# EAGLE design M_D_ext_power2 (EAGLE 9.6.2)
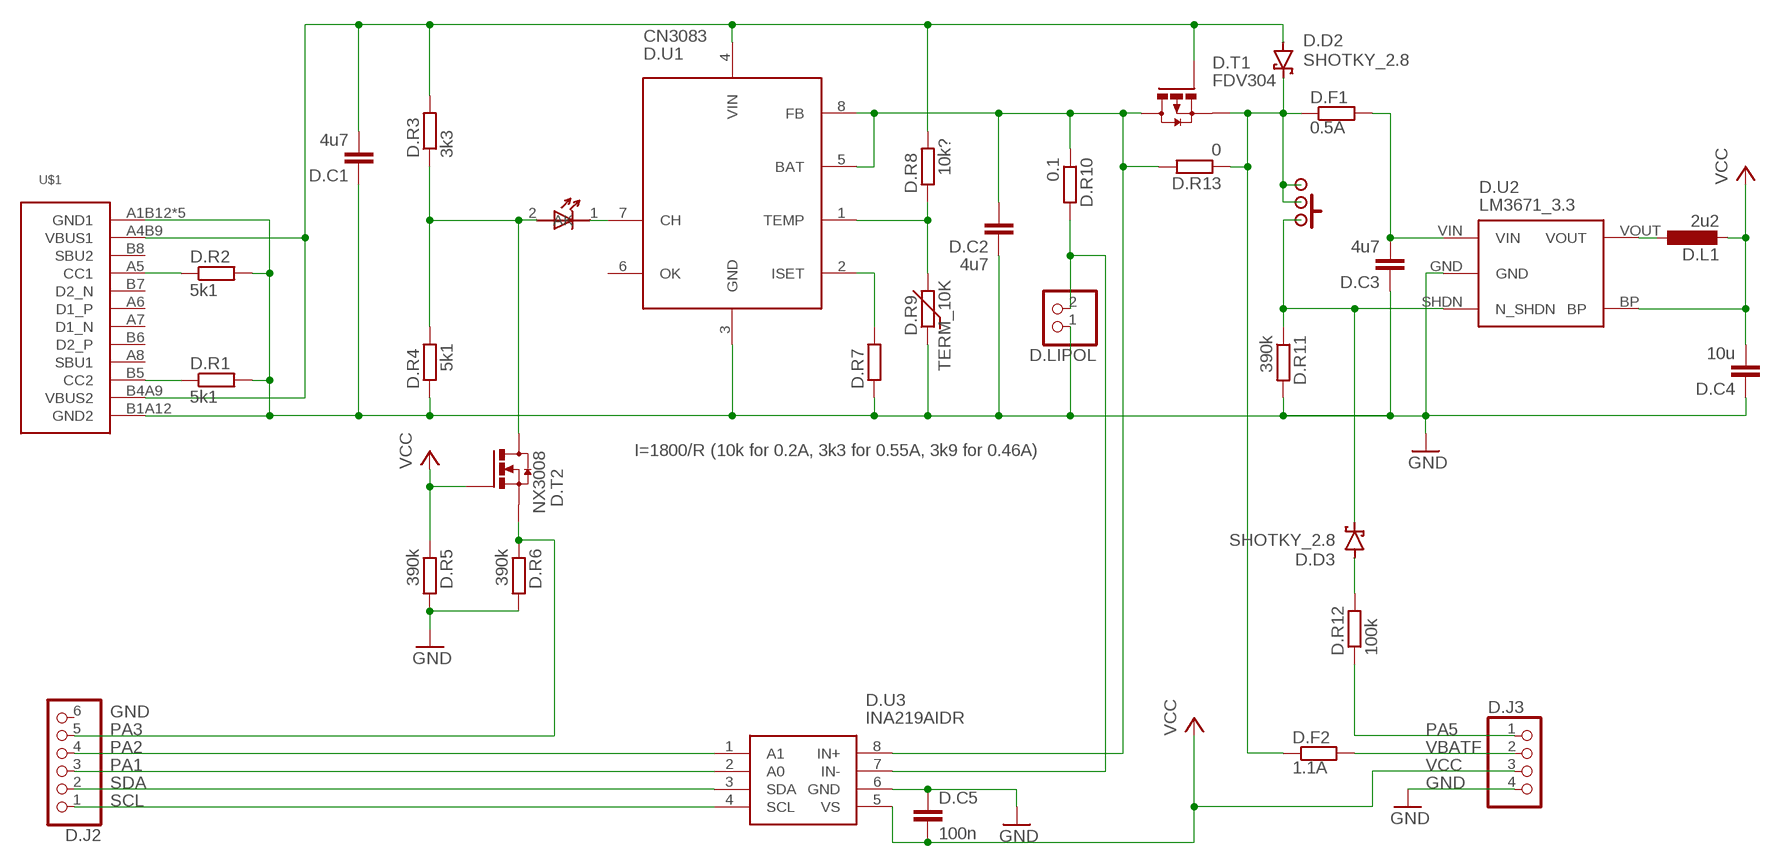
[diagram p0: schematic, sheet 1]

## Parts
D.C1  4u7  C-EUC0603  [C0603]
D.C2  4u7  C-EUC0603  [C0603]
D.C3  4u7  C-EUC0603  [C0603]
D.C4  10u  C-EUC0805  [C0805]
D.C5  100n  C-EUC0603  [C0603]
D.D1  LED_1.8  [LED_1.8]
D.D2  SHOTKY_2.8  [SHOTKY_2.8]
D.D3  SHOTKY_2.8  [SHOTKY_2.8]
D.F1  0.5A  R-EU_R0805  [R0805]
D.F2  1.1A  R-EU_R0805  [R0805]
D.J2  PINHD-1X6  [1X06]
D.J3  PINHD-1X4  [1X04]
D.L1  2u2  L-EUL3230M  [L3230M]
D.LIPOL  PINHD-1X21X2-2  [1X02-2]
D.ON/OFF/RESET  SWITCH  [SWITCH]
D.R1  5k1  R-EU_R0603  [R0603]
D.R2  5k1  R-EU_R0603  [R0603]
D.R3  3k3  R-EU_R0603  [R0603]
D.R4  5k1  R-EU_R0603  [R0603]
D.R5  390k  R-EU_R0603  [R0603]
D.R6  390k  R-EU_R0603  [R0603]
D.R7  I=1800/R (10k for 0.2A, 3k3 for 0.55A, 3k9 for 0.46A)  R-EU_R0603  [R0603]
D.R8  10k?  R-EU_R0603  [R0603]
D.R9  TERM_10K  THERM  [THERM]
D.R10  0.1  R-EU_R0805  [R0805]
D.R11  390k  R-EU_R0603  [R0603]
D.R12  100k  R-EU_R0603  [R0603]
D.R13  0  R-EU_R0603  [R0603]
D.T1  FDV304  P-MOSFET  [SO23]
D.T2  NX3008  N-MOSFET  [SO23]
D.U1  CN3083  [SOP8]
D.U2  LM3671_3.3  STABILISER_APE8865  [SOT32-5]
D.U3  INA219AIDR  [SOIC127P600X175-8N]
U$1  USB-C  [USB-C]

## Nets
CHRG: D.D1.2(A) D.R3.1 D.R4.2 D.T2.D
GND: D.C1.1 D.C2.1 D.C3.1 D.C4.1 D.C5.1 D.J3.4 D.LIPOL.1 D.R1.2 D.R2.2 D.R4.1 D.R5.2 D.R6.2 D.R7.1 D.R9.1 D.R11.2 D.U1.3(GND) D.U2.GND D.U3.6(GND) U$1.A1B12(GND1) U$1.B1A12(GND2) U$1.SH1(GND1) U$1.SH2(GND1) U$1.SH3(GND1) U$1.SH4(GND1)
IN+: D.LIPOL.2 D.R10.2 D.U3.7(IN-)
IN-: D.C2.2 D.R10.1 D.R13.2 D.T1.D D.U1.5(BAT) D.U1.8(FB) D.U3.8(IN+)
N$1: D.C3.2 D.F1.2 D.U2.VIN
N$2: D.L1.1 D.U2.VOUT
N$3: D.D1.1(K) D.U1.7(CH)
N$4: D.R1.1 U$1.B5(CC2)
N$5: D.D3.A D.R12.2
N$6: D.R2.1 U$1.A5(CC1)
N$7: D.R7.2 D.U1.2(ISET)
N$8: D.R8.1 D.R9.2 D.U1.1(TEMP)
N$10: D.D3.K(C) D.ON/OFF/RESET.P$1 D.ON/OFF/RESET.P$5 D.ON/OFF/RESET.P$7 D.R11.1 D.U2.SHDN(N_SHDN)
PA1: D.J2.3 D.U3.2(A0)
PA2: D.J2.4 D.U3.1(A1)
PA3: D.J2.5 D.R6.1 D.T2.S
PA5: D.C1.2 D.D2.A D.R3.2 D.R8.2 D.T1.G D.U1.4(VIN) U$1.A4B9(VBUS1) U$1.B4A9(VBUS2)
PA5-1: D.J3.1 D.R12.1
SCL: D.J2.1 D.U3.4(SCL)
SDA: D.J2.2 D.U3.3(SDA)
VBATF: D.F2.2 D.J3.2
VCC: D.C4.2 D.C5.2 D.J3.3 D.L1.2 D.R5.1 D.T2.G D.U2.BP D.U3.5(VS)
VMOT: D.D2.K(C) D.F1.1 D.F2.1 D.ON/OFF/RESET.P$2 D.ON/OFF/RESET.P$3 D.ON/OFF/RESET.P$4 D.ON/OFF/RESET.P$6 D.R13.1 D.T1.S
Unconnected: D.J2.6 D.U1.6(OK) U$1.A6(D1_P) U$1.A7(D1_N) U$1.A8(SBU1) U$1.B6(D2_P) U$1.B7(D2_N) U$1.B8(SBU2)

## Library data of the parts
D.C1-D.C5 = rcl:C-EU: CAPACITOR, European symbol; SPICEPREFIX: C
D.D1 = hugo:LED_1.8
D.D2 D.D3 = hugo:SHOTKY_2.8
D.F1 D.F2 D.R1-D.R8 D.R10-D.R13 = rcl:R-EU_: RESISTOR, European symbol; SPICEPREFIX: R
D.J2 = pinhead2:PINHD-1X6: PIN HEADER
D.J3 = pinhead2:PINHD-1X4: PIN HEADER
D.L1 = rcl:L-EU: INDUCTOR, European symbol; SPICEPREFIX: L
D.LIPOL = pinhead2:PINHD-1X2: PIN HEADER
D.ON/OFF/RESET = hugo:SWITCH
D.R9 = hugo:THERM
D.T1 = hugo:P-MOSFET
D.T2 = hugo:N-MOSFET
D.U1 = hugo:CN3083
D.U2 = !stavebnice03:STABILISER_APE8865
D.U3 = SamacSys_Parts:INA219AIDR: 26-V, Bidirectional, Zero-Drift, High-Side, I2C Out Current/Power Monitor Source: Datasheet <http://www.ti.com/lit/gpn/ina219>; DESCRIPTION: 26-V, Bidirectional, Zero-Drift, High-Side, I2C Out Current/Power Monitor; HEIGHT: 1.75mm; MANUFACTURER_NAME: Texas Instruments; MANUFACTURER_PART_NUMBER: INA219AIDR; MOUSER_PART_NUMBER: 595-INA219AIDR; MOUSER_PRICE-STOCK: https://www.mouser.co.uk/ProductDetail/Texas-Instruments/INA219AIDR?qs=XGzIaZb%2FFYIE5YcOHTnKDA%3D%3D
U$1 = hugo:USB-C

## Board
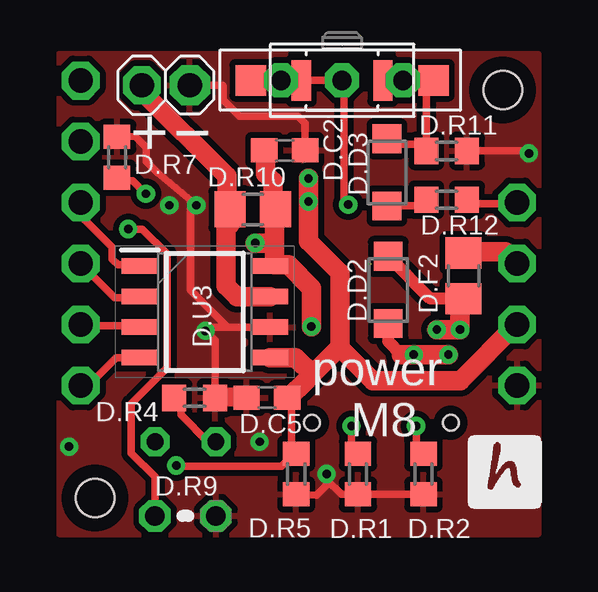
[diagram p1: board, top side]
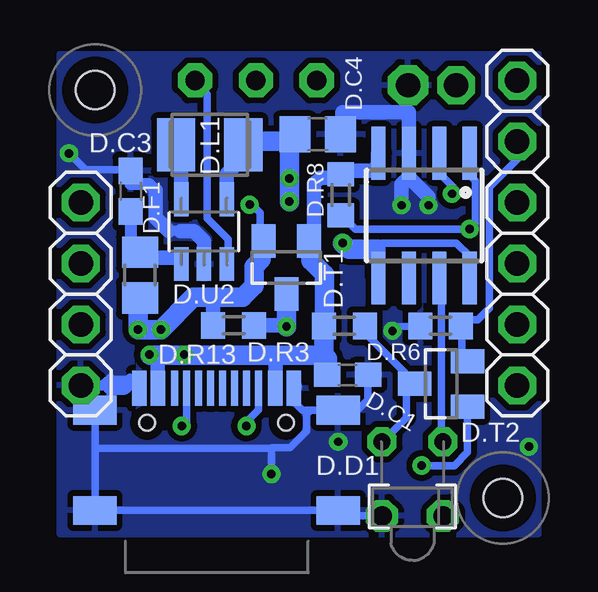
[diagram p2: board, bottom side, seen from below]

No outline drawn. Coordinates in mm, seen from the top.
Copper layers (1*16): Top 0.035mm / dielectric 1.5mm / Bottom 0.035mm
Design rules "default *": minimum track width 10mil, minimum drill 0.35mm, track to track 6mil, track to pad 6mil, pad to pad 6mil, via to via 10mil, smd to smd 10mil, copper to edge 15mil, drill to drill 15mil, minimum pad ring 10mil, minimum via ring 8mil, stop-mask expansion 4mil, vias tented up to drill 14mil, thermal gap 10mil
Holes 1.6 mm at 2,2 19,19
tRestrict: area 18,18 to 20,20; area 1,1 to 3,3
bRestrict: area 1,1 to 3,3; area 18,18 to 20,20

### Footprints (pad centres in the part's own frame; a part is rotated, then mirrored left to right if it is on the bottom)
C0603 = smd 1.1 x 1: 1 -0.85,0; 2 0.85,0
C0805 = smd 1.3 x 1.5: 1 -0.95,0; 2 0.95,0
LED_1.8 = drill 0.7 octagon: 1 -1.27,-0.4; 2 1.27,-0.4
SHOTKY_2.8 = smd 1.2 x 1.2: A -1.4,0; K 1.4,0
R0805 = smd 1.3 x 1.5: 1 -0.95,0; 2 0.95,0
1X06 = drill 1.016 pad 1.575 octagon: 1 -6.35,0; 2 -3.81,0; 3 -1.27,0; 4 1.27,0; 5 3.81,0; 6 6.35,0
1X04 = drill 1.016 pad 1.575 octagon: 1 -3.81,0; 2 -1.27,0; 3 1.27,0; 4 3.81,0
L3230M = smd 1.6 x 2.2: 1 -1.4,0; 2 1.4,0
1X02-2 = drill 1.016 pad 1.676 octagon: 1 -1,0 | drill 1.016 pad 1.575 octagon: 2 1,0
SWITCH = drill 0.8 pad 1.422 octagon: P$1 2.54,0; P$2 0,0; P$3 -2.54,0 | smd 0.8 x 1.7: P$4 -1.7,0; P$5 1.7,0 | smd 1.27 x 1.27: P$6 -3.81,0; P$7 3.81,0
R0603 = smd 1 x 1.1: 1 -0.85,0; 2 0.85,0
THERM = drill 0.813 octagon: 1 -1.27,0; 2 1.27,0
SO23 = smd 1 x 1.4: D 0,1.1; G -0.95,-1.1; S 0.95,-1.1
SOP8 = smd 0.6 x 2.2: 1 -1.905,-2.6; 2 -0.635,-2.6; 3 0.635,-2.6; 4 1.905,-2.6; 5 1.905,2.6; 6 0.635,2.6; 7 -0.635,2.6; 8 -1.905,2.6
SOT32-5 = smd 0.6 x 1.4: BP 0.95,1.35; GND 0,-1.35; SHDN 0.95,-1.35; VIN -0.95,-1.35; VOUT -0.95,1.35
SOIC127P600X175-8N = smd 1.528 x 0.65: 1 -2.711,1.905; 2 -2.711,0.635; 3 -2.711,-0.635; 4 -2.711,-1.905; 5 2.711,-1.905; 6 2.711,-0.635; 7 2.711,0.635; 8 2.711,1.905
USB-C = smd 0.6 x 1.45: A1B12 -3.235,3.825; A4B9 -2.46,3.825; B1A12 3.215,3.825; B4A9 2.44,3.825 | smd 0.3 x 1.45: A5 -1.26,3.825; A6 -0.26,3.825; A7 0.24,3.825; A8 1.24,3.825; B5 1.74,3.825; B6 0.74,3.825; B7 -0.76,3.825; B8 -1.76,3.825 | smd 1.8 x 1.2: SH1 -5.08,2.91; SH2 -5.08,-1.27; SH3 5.06,-1.27; SH4 5.06,2.91 | hole 0.65: 2.88,2.38; -2.9,2.38

### Placement (x,y rotation side)
D.C1  8.47,7.13 180 bottom
D.C2  9.91,16.49 180 top
D.C3  17.53,14.78 270 bottom
D.C4  9.72,17.15 180 bottom
D.C5  9.17,6.17 0 top
D.D1  5.77,3.95 180 bottom
D.D2  14.22,10.67 90 top
D.D3  14.17,15.57 90 top
D.F1  17.13,11.29 90 bottom
D.F2  17.36,11.26 90 top
D.J2  1.4,13.04 90 bottom
D.J3  19.6,10.5 270 bottom
D.L1  14.22,16.71 0 bottom
D.LIPOL  4.95,19.2 180 top
D.ON/OFF/RESET  12.3,19.4 0 top
D.R1  12.96,3 270 top
D.R2  15.7,3 270 top
D.R3  8.61,9.17 180 bottom
D.R4  6.15,6.17 180 top
D.R5  10.39,3 270 top
D.R6  4.6,9.17 180 bottom
D.R7  2.91,16.2 270 top
D.R8  8.76,14.63 90 bottom
D.R9  5.77,1.25 180 top
D.R10  8.58,14.03 180 top
D.R11  16.66,16.46 0 top
D.R12  16.66,14.43 180 top
D.R13  13.23,9.19 0 bottom
D.T1  11.03,11.61 180 bottom
D.T2  4.57,6.76 90 bottom
D.U1  5.28,13.77 180 bottom
D.U2  14.47,13.1 0 bottom
D.U3  6.58,9.75 0 top
U$1  13.93,2.75 0 bottom

### Tracks (layer width: path | path; a pad name or v marks a point on that pad's centre or on a via)
CHRG
  Top 0.305: D.R4.2 5.58,5.89 5.58,5.47 6.7,4.35 D.D1.2
  Bottom 0.305: 7.76,9.05 D.R3.1 7.76,8.89 5.67,6.8 D.T2.D 6.03,6.4 6.03,5.35 D.D1.2
GND  (via drill 0.35)
  Top 0.305: D.C2.1 10.76,17.02 | 2.86,17.13 D.R7.1 | D.R7.1 3.14,16.86 | D.C2.1 10.87,16.38 | D.R7.1 3.67,17.08 4.14,16.61 4.14,16.03 4.61,15.55 v6.22,14.2 5.98,14.37 5.98,10.66 7.52,9.12 | D.R5.2 11.23,2.12 11.65,2.54 v11.65,3 11.65,2.77 12.27,2.15 D.R1.2 D.R2.2 | D.LIPOL.1 7.33,19.2 7.34,19.19 7.34,18.59 8.03,17.91 10.46,17.91 10.76,17.61 D.C2.1 | D.U3.6 7.52,9.12 | D.R4.1 7,8.57 v6.6,8.97 6.75,9.12 7.52,9.12 | D.R11.2 19.99,16.46 v20.09,16.36
  Top 0.813: D.C5.1 8.31,6.19 7.05,6.24 D.R4.1
  Bottom 0.254: 6.15,17.97 6.03,18.08
  Bottom 0.305: 11.65,4.07 18.99,4.07 19.01,4.09 | U$1.SH4 8.92,5.71 9.45,5.71 9.33,5.59 8.13,5.59 7.62,6.1 D.C1.1 | U$1.SH1 19.01,4.09 | 19.01,4.09 U$1.SH2 U$1.SH3 8.64,1.25 D.R9.1 | 11.65,3.13 v11.65,3 | v11.65,3 11.63,2.97 | v20.09,16.36 19.41,15.67 17.57,15.67 D.C3.1 17.53,15.09 | v11.65,3 11.65,4.07 | D.R6.2 6.43,9.14 v6.6,8.97 | D.LIPOL.1 5.95,18.11 5.92,18.08 | 11.65,4.07 11.63,4.09 10.87,4.09 10.19,4.78 10.19,5.49 10.02,5.66 U$1.SH4 | U$1.B1A12 10.71,6.01 10.37,5.66 U$1.SH4
  Bottom 0.406: 18.37,6.98 18.5,6.85 | 18.5,6.85 18.66,6.69 | U$1.A1B12 17.56,6.97 17.84,6.69 | 18.66,6.69 D.J3.4 19.6,6.25 | 18.66,6.69 18.31,6.69 | 18.5,6.85 18.34,6.68 18.34,5.71 | 15.44,13.11 15.47,13.14 15.94,13.14
  Bottom 0.508: 17.53,15.09 16.76,15.09 16.48,14.81
  Bottom 0.61: D.U2.GND 14.46,12.7 14.88,13.11 15.44,13.11 | 8.81,5.84 8.87,5.79 U$1.SH4 8.74,5.79 | 19.6,6.25 U$1.SH1 | D.C4.1 8.69,17.15 8.69,18.07 6.51,18.07 | 6.43,18.08 6.03,18.08 5.92,18.08 D.U1.3 5.92,15.37 | U$1.B1A12 10.66,6.63 | 15.94,13.14 16.48,13.68 16.48,14.81 | 5.92,15.37 5.1,14.55 v5.1,14.2 | v6.22,14.2 6.22,15.07 5.92,15.37
  Bottom 0.813: 18.31,6.69 17.84,6.69
  other vias: 0.91,4.14 8.86,4.34
  pour Top (isolate 0.254): 0.5,20.5 0.5,0.5 20.5,0.5 20.5,20.5
  pour Bottom (isolate 0.254, rank 3): 0.5,20.5 20.5,20.5 20.5,0.5 0.5,0.5
IN+
  Top 0.813: D.LIPOL.2 3.95,18.95 7.5,15.4 7.5,14.38 7.62,14.25 D.R10.2 7.62,13.42 7.47,13.26 7.47,10.84 7.91,10.39 D.U3.7
IN-  (via drill 0.35)
  Top 0.305: 9.31,11.63 D.U3.8 9.39,11.76 9.39,12.62
  Top 0.61: v8.68,12.62 9.39,12.62
  Top 0.813: D.R10.1 9.42,14.13 9.42,15.19 9.11,15.5 9.11,16.44 D.C2.2 | D.R10.1 9.61,14.03 | v11.02,9.14 11.02,10.74 10.06,11.71 9.47,11.71 9.47,12.62 | D.R10.1 9.47,13.97 9.47,12.62 | v8.68,12.62 9.47,12.62
  Bottom 0.305: D.U1.5 7.19,12.42 | 7.19,12.47 7.04,12.62 3.94,12.62 3.38,12.06 D.U1.8
  Bottom 0.508: 7.29,12.37 7.19,12.47
  Bottom 0.61: 7.19,11.76 D.U1.5 7.19,12.47 | D.R13.2 11.07,9.2 v11.02,9.14
  Bottom 0.813: D.T1.D 11.02,10.5 v11.02,9.14 | v8.68,12.62 8.43,12.37 7.29,12.37
N$1
  Bottom 0.305: D.U2.VIN 15.41,11.93 15.49,12.01 | 16.91,12.01 D.F1.2
  Bottom 0.508: D.C3.2 17.53,12.63 D.F1.2
  Bottom 0.61: 16.91,12.01 15.49,12.01
  Bottom 0.813: D.F1.2 16.98,12.23
N$2
  Bottom 0.61: D.U2.VOUT 15.41,15.97 15.62,16.18 D.L1.1
N$3
  Bottom 0.305: D.U1.7 4.57,11.09 4.57,4.42 D.D1.1
N$4  (via drill 0.35)
  Top 0.305: D.R1.1 12.69,4.14 v12.69,5
  Bottom 0.305: U$1.B5 12.19,5.68 12.69,5.18 v12.69,5
N$5
  Top 0.305: D.D3.A 15.37,14.17 15.62,14.43 D.R12.2
N$6  (via drill 0.35)
  Top 0.305: v15.39,5 15.39,4.22 15.46,4.08 D.R2.1
  Bottom 0.305: U$1.A5 15.19,5.2 v15.39,5
N$7  (via drill 0.35)
  Top 0.305: 3.04,15.38 D.R7.2 2.91,15.21 3.56,15.21 4.09,14.68 v4.12,14.68
  Bottom 0.305: D.U1.2 4.65,15.53 4.07,14.95 4.07,14.73 v4.12,14.68
N$8  (via drill 0.35)
  Top 0.305: v3.38,13.21 3.97,13.21 5,12.17 5,7.42 3.5,5.92 3.5,3.87 4.5,2.88 D.R9.2
  Bottom 0.305: D.R8.1 8.71,13.78 8.14,13.21 v3.38,13.21 3.15,13.44 3.15,15.22 3.38,15.45 D.U1.1
N$10  (1 unrouted)
  Top 0.305: 14.54,17.33 D.D3.K 14.4,16.74 15.53,16.74 D.R11.1 15.81,19.31 15.9,19.4 | D.ON/OFF/RESET.P$5 D.ON/OFF/RESET.P$1 15.9,19.4 | 15.9,19.4 D.ON/OFF/RESET.P$7
  Bottom 0.305: 13.46,11.8 13.46,12.79 14.34,13.67 14.34,18.83 14.84,19.33 D.ON/OFF/RESET.P$1
PA1
  Top 0.305: D.U3.2 3.83,10.35 2.81,10.35 D.J2.3
PA2
  Top 0.305: D.U3.1 3.82,11.71 2.96,11.71 2.72,11.95 2.72,12.45 1.4,13.77 D.J2.4
PA3
  Bottom 0.305: D.J2.5 1.4,16.11 2.57,14.94 2.57,9.9 3.05,9.42 3.58,9.42 3.58,8.98 3.75,9.14 D.R6.1 3.7,9.12 3.7,7.93 D.T2.S
PA5  (via drill 0.35)
  Top 0.305: v15.29,7.98 v16.74,7.98 v16.74,7.97
  Top 0.508: 14.78,7.97 14.22,8.53 D.D2.A
  Top 0.813: v16.74,7.97 14.78,7.97
  Bottom 0.305: 9.68,9.17 D.R3.2 9.42,9.21 9.44,9.23 | v16.74,7.97 v16.74,7.98 | v16.74,7.97 16.72,7.96 | v16.74,7.97 16.7,7.95 16.39,7.95
  Bottom 0.61: 10.08,12.83 D.T1.G 9.88,12.91 9.88,15.09 9.62,15.35 8.91,15.35 8.79,15.48 D.R8.2 8.61,15.63 7.44,15.63 7.21,15.86 7.21,16.37 D.U1.4 | v16.74,7.97 16.71,7.97 | 11.49,7.02 U$1.B4A9 11.49,7.87 11.4,7.96 | U$1.A4B9 16.39,7.95 16.36,7.98
  Bottom 0.813: 16.72,7.96 11.4,7.96 9.46,7.96 | D.T1.G 10.01,12.63 10.01,11.89 9.44,11.33 9.44,9.23 9.39,9.18 | D.C1.2 9.32,7.81 9.46,7.96 | D.R3.2 9.46,7.96
PA5-1
  Top 0.305: D.R12.1 17.46,14.26 19.55,14.26 D.J3.1
SCL
  Top 0.305: D.U3.4 2.89,7.85 1.73,6.69 D.J2.1
SDA
  Top 0.305: 3.86,9.13 D.U3.3 3.82,9.17 1.46,9.17 D.J2.2
VBATF
  Top 0.813: D.J3.2 19.12,12.25 17.41,12.25 D.F2.2
VCC  (via drill 0.35)
  Top 0.305: v5.38,3.35 5.41,3.33 9.77,3.33 10.26,3.82 D.R5.1 | D.C5.2 10.17,6.03 | 10.2,4.01 D.R5.1 | D.C5.2 10.25,6.19 10.95,6.89 | 10.97,7.07 10.82,6.92 | D.R5.1 10.19,4.02 10.19,6 D.C5.2
  Top 0.61: D.U3.5 9.31,7.87
  Top 0.813: v10.9,14.35 10.9,12.69 12.22,11.38 12.22,8.26 | D.J3.3 19.58,9.23 17.24,6.89 13.59,6.89 12.22,8.26 | D.C5.2 10.07,6.17 10.82,6.92 11.06,7.16 | D.U3.5 10.37,7.85 11.06,7.16 | v10.9,14.35 10.9,15.17 10.89,15.24 | v10.9,15.32 v10.9,15.31 v10.9,14.35 | 11.06,7.16 12.19,8.29 12.22,8.26
  Bottom 0.305: v10.9,14.35 10.82,14.34 | D.T2.G 3.47,3.91 4.03,3.35 v5.38,3.35
  Bottom 0.61: D.L1.2 12.82,16.19 13.51,15.5 D.U2.BP | 12.35,17.18 D.L1.2 | D.C4.2 10.84,16.98 11.99,16.98 11.89,16.87 | D.L1.2 12.66,16.87 | 10.89,16.67 11.1,16.87
  Bottom 0.813: 11.1,16.87 11.89,16.87 12.66,16.87 | v10.9,14.35 v10.89,14.35 10.89,16.67
VMOT  (via drill 0.35)
  Top 0.305: D.ON/OFF/RESET.P$6 D.ON/OFF/RESET.P$3 D.ON/OFF/RESET.P$4 D.ON/OFF/RESET.P$2 12.38,19.32 12.38,14.4 v12.56,14.22
  Top 0.508: D.F2.1 15.98,10.31 D.D2.K
  Top 0.813: 17.22,10.16 D.F2.1 17.22,10.16 | 17.22,9.88 17.22,10.16 | 16.41,9.02 v16.26,9.02 v17.22,9.02 17.22,10.16
  Bottom 0.254: 17.49,10.54 17.34,10.54 D.F1.1
  Bottom 0.305: D.T1.S 12.13,12.85 12.13,13.89 12.46,14.22 v12.56,14.22
  Bottom 0.61: D.R13.1 14.08,10.3 14.15,10.36
  Bottom 0.813: D.T1.S 12.08,12.6 12.08,11.94 12.38,11.64 12.38,10.84 12.86,10.36 14.15,10.36 14.91,10.36 v16.26,9.02 v17.21,9.02 17.21,10.26 D.F1.1

### Text on the board
tPlace: + | − | power / M8